# Altium project AL115v20.PrjPcb
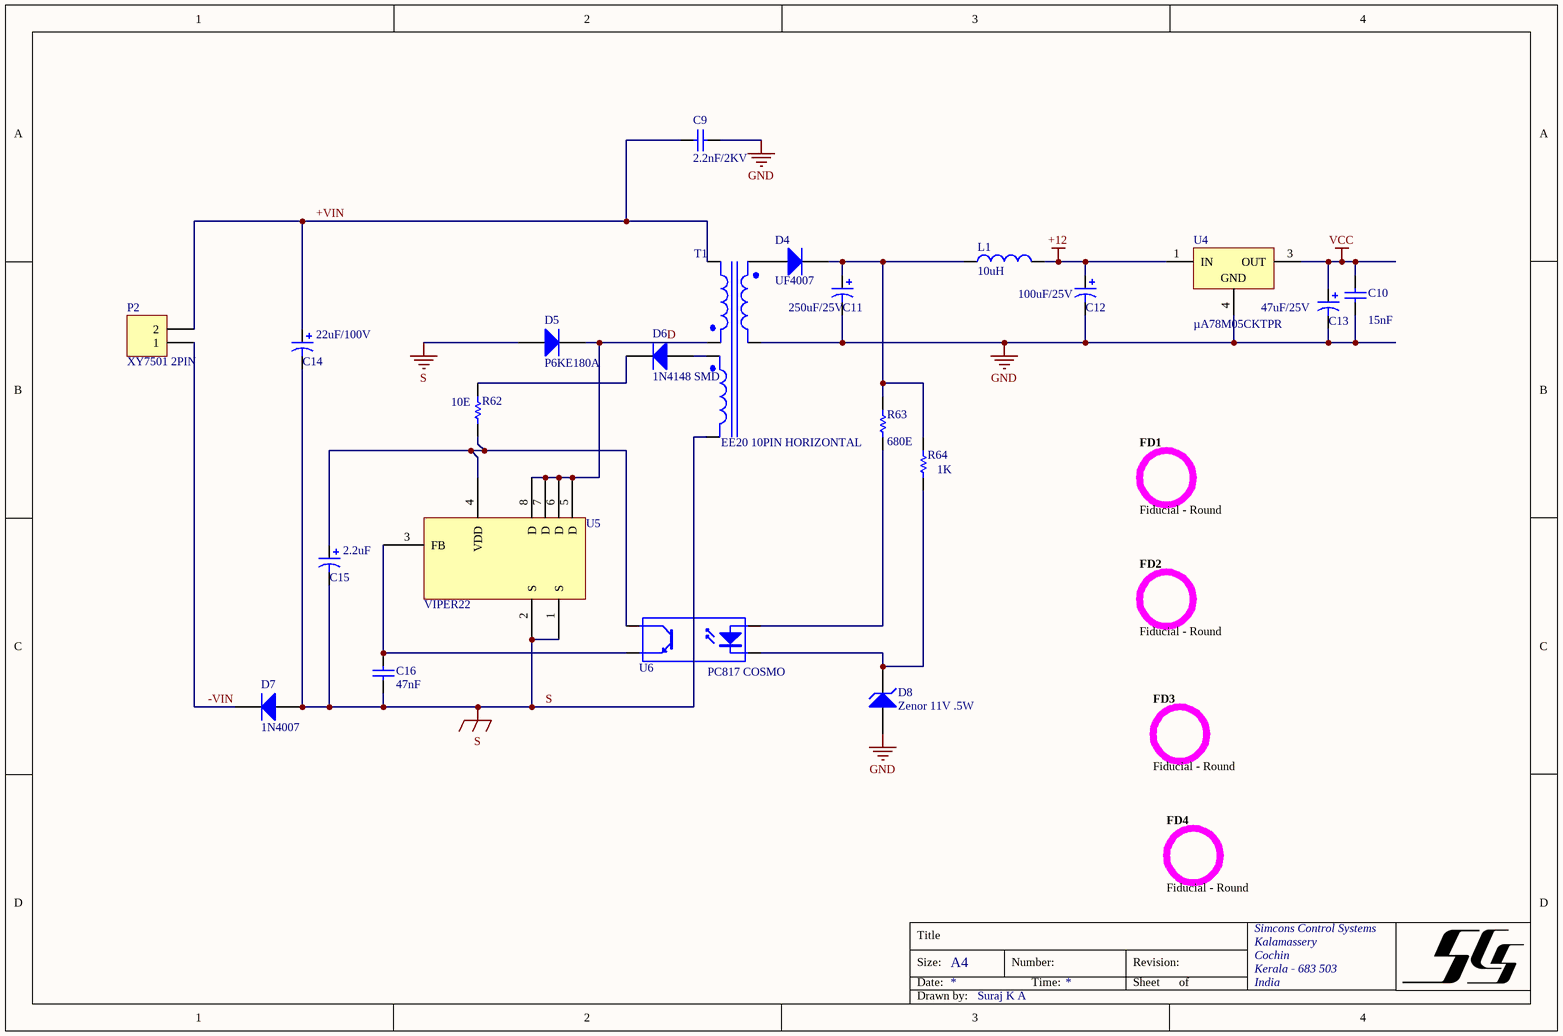
[diagram p0: al115v20_power.SchDoc]
4 sheets, 126 parts. Net scope: global (net labels, ports and power ports of the same name join across sheets).
Board file: AL115v20_pcb.PcbDoc
Sheets:
  al115v20_power.SchDoc
  al115v20_ac.SchDoc
  al115v20_mcu.SchDoc
  al115v20_relays.SchDoc

## Sheet al115v20_power.SchDoc
size A4; DrawnBy: Suraj K A; Engineer: Suraj K A; Organization: Simcons Control Systems; Address1: HMT Colony PO; Address2: Kalamassery; Address3: Cochin; Address4: India

### Parts
C9  2.2nF/2kV  [CAP DISC .2]
C10  value 15nF  [C1206]  (hidden comment: .1uF 1206)
C11  value 250uF/25V  [Cap_.2]  (hidden comment: 470uF/25V)
C12  100uF/25V  [Cap_.6.3x11x2.5]
C13  value 47uF/25V  [Cap_.6.3x11x2.5]  (hidden comment: 100uF/25V)
C14  22uF/100V  [Cap_.2]
C15  value 2.2uF  [Cap_.1]  (hidden comment: 10uF/63V)
C16  value 47nF  [C1206]  (hidden comment: 47nF 1206)
D4  UF4007  [DIODE1A]
D5  P6KE180A  [DIODE1A]
D6  1N4148 SMD  [4148SMDW]
D7  1N4007  [DIODE1A]
D8  Zenor 11V .5W  [DZENOR .25W - duplicate]
FD1  Fiducial - Round  [FIDUCIAL 2mm]
FD2  Fiducial - Round  [FIDUCIAL 2mm]
FD3  Fiducial - Round  [FIDUCIAL 2MM]
FD4  Fiducial - Round  [FIDUCIAL 2MM]
L1  value 10uH  [INDUCTOR 5x8]  (hidden comment: Inductor 10uH Drum Core)
P2  XY7501 2PIN  [XY7501_7.62_2PIN]
R62  value 10E  [R1206]  (hidden comment: 10E 1206)
R63  value 680E  [R1206]  (hidden comment: 100E 1206)
R64  value 1K  [R1206]  (hidden comment: 1K 1206)
T1  EE20 10PIN HORIZONTAL  [EE20_HOR_10PIN]
U4  µA78M05CKTPR  [TO252AA]
U5  VIPER22  [DIP-8_S]
U6  PC817 COSMO  [DIP-4_S]

### Nets
+12: C12.1 L1.2 U4.1(IN)
GND: C9.1 C10.1 C11.2 C12.2 C13.2 D8.1(A) T1.7(Sec1-) U4.4(GND)
S: C14.2 C15.2 C16.2 D5.1(A) D7.1(A) T1.5(Sec2+) U5.1(S) U5.2(S)
VCC: C10.2 C13.1 U4.3(OUT)
+VIN: C9.2 C14.1 P2.2 T1.1(Pri+)
-VIN: D7.2(K) P2.1
D: D5.2(K) T1.2(Pri-) U5.5(D) U5.6(D) U5.7(D) U5.8(D)
NetC11_1: C11.1 D4.2(K) L1.1 R63.2 R64.2
NetC15_1: C15.1 R62.1 U5.4(VDD) U6.4(C)
NetC16_1: C16.1 U5.3(FB) U6.3(E)
NetD4_1: D4.1(A) T1.9(Sec1+)
NetD6_1: D6.1(A) T1.4(Sec2-)
NetD6_2: D6.2(K) R62.2
NetD8_2: D8.2(K) R64.1 U6.2(K)
NetR63_1: R63.1 U6.1(A)

### Notes on the sheet
- Title
- Size:
- Date:
- A4
- Number:
- Time:
- Revision:
- Sheet
- of
- Simcons Control Systems
- Kalamassery
- Cochin
- Kerala - 683 503
- India
- Drawn by:

### Library data of the parts
C9 C10 C16 = Cap: Capacitor; Published: 8-Jun-2000; LatestRevisionDate: 17-Jul-2002; LatestRevisionNote: Re-released for DXP Platform.; PackageReference: RAD-0.3; Publisher: Altium Limited; PackageDescription: Radial Cap, Thru-Hole; 2 Leads; 0.3 in Pin Spacing
  C9: Value: 2.2nF/2KV
C11-C15 = Cap Pol1: Polarized Capacitor (Radial); Published: 8-Jun-2000; LatestRevisionDate: 17-Jul-2002; LatestRevisionNote: Re-released for DXP Platform.; PackageReference: RB7.6-15; Publisher: Altium Limited; PackageDescription: Polarized Capacitor (Radial); 2 Leads
  C12: Value: 100uF/25V
  C14: Value: 22uF/100V
D4-D7 = Diode: Default Diode; Published: 8-Jun-2000; LatestRevisionDate: 17-Jul-2002; LatestRevisionNote: Re-released for DXP Platform.; PackageVersion: Sep-1996; PackageReference: SMC; Publisher: Altium Limited; PackageDescription: DO-214-AB/SMC; 2 C-Bend Leads; Body 7.9 x 5.9 mm, inc. leads (LxW); Code_JEDEC: DO-214-AB
D8 = D Zener: Zener Diode; Published: 8-Jun-2000; LatestRevisionDate: 17-Jul-2002; LatestRevisionNote: Re-released for DXP Platform.; PackageReference: DIODE-0.7; Publisher: Altium Limited; PackageDescription: Diode, Thru-Hole; 2 Leads; 0.7 in Pin Spacing
FD1-FD4 = FIDUCIAL ROUND: Fiducial - Round 1.5mm Top-Bottom; Status: Unreleased; Category: Graphic-PCB
L1 = Inductor: Code_IEC: 1005; Published: 8-Jun-2000; LatestRevisionDate: 29-May-2009; LatestRevisionNote: IPC-7351 Footprint Added.; PackageReference: 0402-A; Publisher: Altium Limited; PackageDescription: Chip Inductor; Code_JEITA: 0402
P2 = Header 2: Header, 2-Pin; LatestRevisionDate: 17-Jul-2002; LatestRevisionNote: Re-released for DXP Platform.; Publisher: Altium Limited
R62 = Res Semi: Semiconductor Resistor; Published: 8-Jun-2000; LatestRevisionDate: 17-Jul-2002; LatestRevisionNote: Re-released for DXP Platform.; PackageReference: AXIAL-0.5; Publisher: Altium Limited; PackageDescription: Axial Device, Thru-Hole; 2 Leads; 0.5 in Pin Spacing
R63 R64 = Res1: Resistor; Published: 8-Jun-2000; LatestRevisionDate: 17-Jul-2002; LatestRevisionNote: Re-released for DXP Platform.; PackageReference: AXIAL-0.3; Publisher: Altium Limited; PackageDescription: Axial Device, Thru-Hole; 2 Leads; 0.3 in Pin Spacing
T1 = TransSwitching: Three-winding Transformer (Switching; Sim Note: Enter the turns ratios, Core loss resistance, Magnetising Reactance, Leakage Reactances and Resistances referred to the primary side into the parameter fields.; Published: 25-Jan-2001; LatestRevisionDate: 17-Jul-2002; LatestRevisionNote: Re-released for DXP Platform.; PackageReference: TRF_6; Publisher: Altium Limited; PackageDescription: Transformer; 6 Leads
U4 = µA78M05CKTPR: Positive-Voltage Regulator; Note: Pin 2 is electrically connected to pin4, and not drawn.; Published: 15-Apr-2002; DatasheetVersion: Jul-1999; PackageVersion: Jan-2001; PackageReference: KTP02; Publisher: Altium Limited; PackageDescription: PowerFLEX (D-PAK/TO-252-AA); 3 Leads (1 Cropped); Body 9.7 (inc. leads) x 6.2 mm (LxW max); Code_JEDEC: TO-252; ComponentLink1Description: Manufacturer Link; ComponentLink1URL: http://www.ti.com/; ComponentLink2Description: Datasheet; ComponentLink2URL: http://www-s.ti.com/sc/ds/ua78m05.pdf
U5 = VIPER22: Manufacturer: Power Integrations; PART NAME: Top Switch II Family
U6 = Optoisolator1: 4-Pin Phototransistor Optocoupler; Published: 24-Mar-1999; LatestRevisionDate: 04-Mar-2005; LatestRevisionNote: Sch pins 3 & 4 Swapped.; DatasheetVersion: Nov-2003; PackageReference: DIP-4; Publisher: Altium Limited

## Sheet al115v20_ac.SchDoc
size A4; DrawnBy: Suraj K A; Engineer: Suraj K A; Organization: Simcons Control Systems; Address1: HMT Colony PO; Address2: Kalamassery; Address3: Cochin; Address4: India
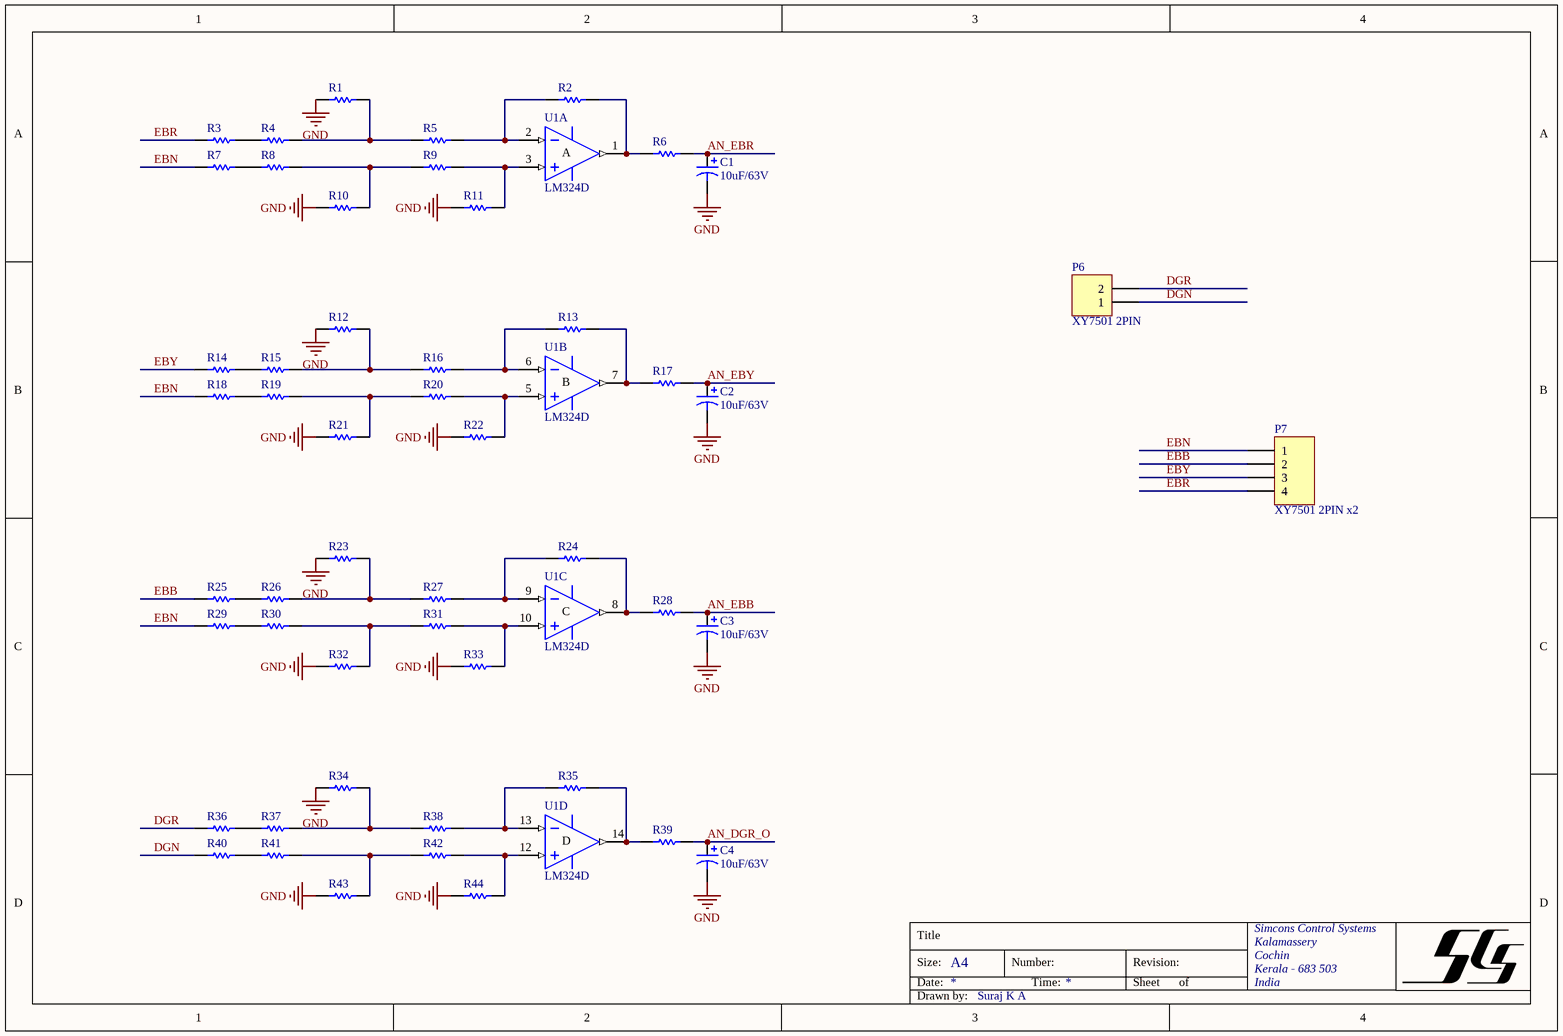
[diagram p1: al115v20_ac.SchDoc]

### Parts
C1  value 10uF/63V  [C1206]  (hidden comment: 1uF 1206)
C2  value 10uF/63V  [C1206]  (hidden comment: 1uF 1206)
C3  value 10uF/63V  [C1206]  (hidden comment: 1uF 1206)
C4  value 10uF/63V  [C1206]  (hidden comment: 1uF 1206)
P6  XY7501 2PIN  [XY7501_7.62_2PIN]
P7  XY7501 2PIN x2  [XY7501_7.62_4PIN]
R1  4.7K 1206  [R1206]  (value not drawn)
R2  1M 1206  [R1206]  (value not drawn)
R3  MFR 1M .5W  [AXIAL-0.5]  (value not drawn)
R4  MFR 1M .5W  [AXIAL-0.5]  (value not drawn)
R5  220K 1206  [R1206]  (value not drawn)
R6  470K 1206  [R1206]  (value not drawn)
R7  MFR 1M .5W  [AXIAL-0.5]  (value not drawn)
R8  MFR 1M .5W  [AXIAL-0.5]  (value not drawn)
R9  220K 1206  [R1206]  (value not drawn)
R10  4.7K 1206  [R1206]  (value not drawn)
R11  1M 1206  [R1206]  (value not drawn)
R12  4.7K 1206  [R1206]  (value not drawn)
R13  1M 1206  [R1206]  (value not drawn)
R14  MFR 1M .5W  [AXIAL-0.5]  (value not drawn)
R15  MFR 1M .5W  [AXIAL-0.5]  (value not drawn)
R16  220K 1206  [R1206]  (value not drawn)
R17  470K 1206  [R1206]  (value not drawn)
R18  MFR 1M .5W  [AXIAL-0.5]  (value not drawn)
R19  MFR 1M .5W  [AXIAL-0.5]  (value not drawn)
R20  220K 1206  [R1206]  (value not drawn)
R21  4.7K 1206  [R1206]  (value not drawn)
R22  1M 1206  [R1206]  (value not drawn)
R23  4.7K 1206  [R1206]  (value not drawn)
R24  1M 1206  [R1206]  (value not drawn)
R25  MFR 1M .5W  [AXIAL-0.5]  (value not drawn)
R26  MFR 1M .5W  [AXIAL-0.5]  (value not drawn)
R27  220K 1206  [R1206]  (value not drawn)
R28  470K 1206  [R1206]  (value not drawn)
R29  MFR 1M .5W  [AXIAL-0.5]  (value not drawn)
R30  MFR 1M .5W  [AXIAL-0.5]  (value not drawn)
R31  220K 1206  [R1206]  (value not drawn)
R32  4.7K 1206  [R1206]  (value not drawn)
R33  1M 1206  [R1206]  (value not drawn)
R34  4.7K 1206  [R1206]  (value not drawn)
R35  1M 1206  [R1206]  (value not drawn)
R36  MFR 1M .5W  [AXIAL-0.5]  (value not drawn)
R37  MFR 1M .5W  [AXIAL-0.5]  (value not drawn)
R38  220K 1206  [R1206]  (value not drawn)
R39  470K 1206  [R1206]  (value not drawn)
R40  MFR 1M .5W  [AXIAL-0.5]  (value not drawn)
R41  MFR 1M .5W  [AXIAL-0.5]  (value not drawn)
R42  220K 1206  [R1206]  (value not drawn)
R43  4.7K 1206  [R1206]  (value not drawn)
R44  1M 1206  [R1206]  (value not drawn)
U1  LM324D  [SOIC14_M]  (parts A,B,C,D of 4)

### Nets
GND: C1.2 C2.2 C3.2 C4.2 R1.2 R10.2 R11.2 R12.2 R21.2 R22.2 R23.2 R32.2 R33.2 R34.2 R43.2 R44.2 U1.11(V-)
VCC: U1.4(V+)
AN_DGR_O: C4.1 R39.1
AN_EBB: C3.1 R28.1
AN_EBR: C1.1 R6.1
AN_EBY: C2.1 R17.1
DGN: P6.1 R40.1
DGR: P6.2 R36.1
EBB: P7.2 R25.1
EBN: P7.1 R7.1 R18.1 R29.1
EBR: P7.4 R3.1
EBY: P7.3 R14.1
NetR1_1: R1.1 R4.2 R5.2
NetR2_1: R2.1 R6.2 U1.1(OUT)
NetR2_2: R2.2 R5.1 U1.2(IN-)
NetR3_2: R3.2 R4.1
NetR7_2: R7.2 R8.1
NetR8_2: R8.2 R9.2 R10.1
NetR9_1: R9.1 R11.1 U1.3(IN+)
NetR12_1: R12.1 R15.2 R16.2
NetR13_1: R13.1 R17.2 U1.7(OUT)
NetR13_2: R13.2 R16.1 U1.6(IN-)
NetR14_2: R14.2 R15.1
NetR18_2: R18.2 R19.1
NetR19_2: R19.2 R20.2 R21.1
NetR20_1: R20.1 R22.1 U1.5(IN+)
NetR23_1: R23.1 R26.2 R27.2
NetR24_1: R24.1 R28.2 U1.8(OUT)
NetR24_2: R24.2 R27.1 U1.9(IN-)
NetR25_2: R25.2 R26.1
NetR29_2: R29.2 R30.1
NetR30_2: R30.2 R31.2 R32.1
NetR31_1: R31.1 R33.1 U1.10(IN+)
NetR34_1: R34.1 R37.2 R38.2
NetR35_1: R35.1 R39.2 U1.14(OUT)
NetR35_2: R35.2 R38.1 U1.13(IN-)
NetR36_2: R36.2 R37.1
NetR40_2: R40.2 R41.1
NetR41_2: R41.2 R42.2 R43.1
NetR42_1: R42.1 R44.1 U1.12(IN+)

### Notes on the sheet
- Title
- Size:
- Date:
- A4
- Number:
- Time:
- Revision:
- Sheet
- of
- Simcons Control Systems
- Kalamassery
- Cochin
- Kerala - 683 503
- India
- Drawn by:
- (in symbol LM324D, part A) A
- (in symbol LM324D, part B) B
- (in symbol LM324D, part C) C
- (in symbol LM324D, part D) D

### Library data of the parts
C1-C4 = Cap Pol1: Polarized Capacitor (Radial); Published: 8-Jun-2000; LatestRevisionDate: 17-Jul-2002; LatestRevisionNote: Re-released for DXP Platform.; PackageReference: RB7.6-15; Publisher: Altium Limited; PackageDescription: Polarized Capacitor (Radial); 2 Leads
P6 = Header 2: Header, 2-Pin; LatestRevisionDate: 17-Jul-2002; LatestRevisionNote: Re-released for DXP Platform.; Publisher: Altium Limited
P7 = Header 4: Header, 4-Pin; LatestRevisionDate: 17-Jul-2002; LatestRevisionNote: Re-released for DXP Platform.; Publisher: Altium Limited
R1-R5 R7-R16 R18-R27 R29-R38 R40-R44 = Res Semi: Semiconductor Resistor; Published: 8-Jun-2000; LatestRevisionDate: 17-Jul-2002; LatestRevisionNote: Re-released for DXP Platform.; PackageReference: AXIAL-0.5; Publisher: Altium Limited; PackageDescription: Axial Device, Thru-Hole; 2 Leads; 0.5 in Pin Spacing
  R1 R10 R12 R21 R23 R32 R34 R43: Value: 4.7K
  R2-R4 R7 R8 R11 R13-R15 R18 R19 R22 R24-R26 R29 R30 R33 R35-R37 R40 R41 R44: Value: 1M
  R5 R9 R16 R20 R27 R31 R38 R42: Value: 220K
R6 R17 R28 R39 = Res Semi: Semiconductor Resistor; Value: 33K; Published: 8-Jun-2000; LatestRevisionDate: 17-Jul-2002; LatestRevisionNote: Re-released for DXP Platform.; PackageReference: AXIAL-0.5; Publisher: Altium Limited; PackageDescription: Axial Device, Thru-Hole; 2 Leads; 0.5 in Pin Spacing
U1 = LM324D: Quadruple Operational Amplifier; Published: 16-Jan-2001; LatestRevisionDate: 13-Apr-2006; LatestRevisionNote: IPC-7351 Footprint Added.; DatasheetVersion: Feb-1997; PackageVersion: Jan-1998; PackageReference: D014; Publisher: Altium Limited; PackageDescription: 14-Pin Small Outline Integrated Circuit 1.27 mm Pitch; Code_IPC: SOIC127P600-14; ComponentLink1Description: Manufacturer Link; ComponentLink1URL: http://www.ti.com/; ComponentLink2Description: Datasheet; ComponentLink2URL: http://www-s.ti.com/sc/ds/lm324.pdf

## Sheet al115v20_mcu.SchDoc
size A4; DrawnBy: Suraj K A; Engineer: Suraj K A; Organization: Simcons Control Systems; Address1: HMT Colony PO; Address2: Kalamassery; Address3: Cochin; Address4: India
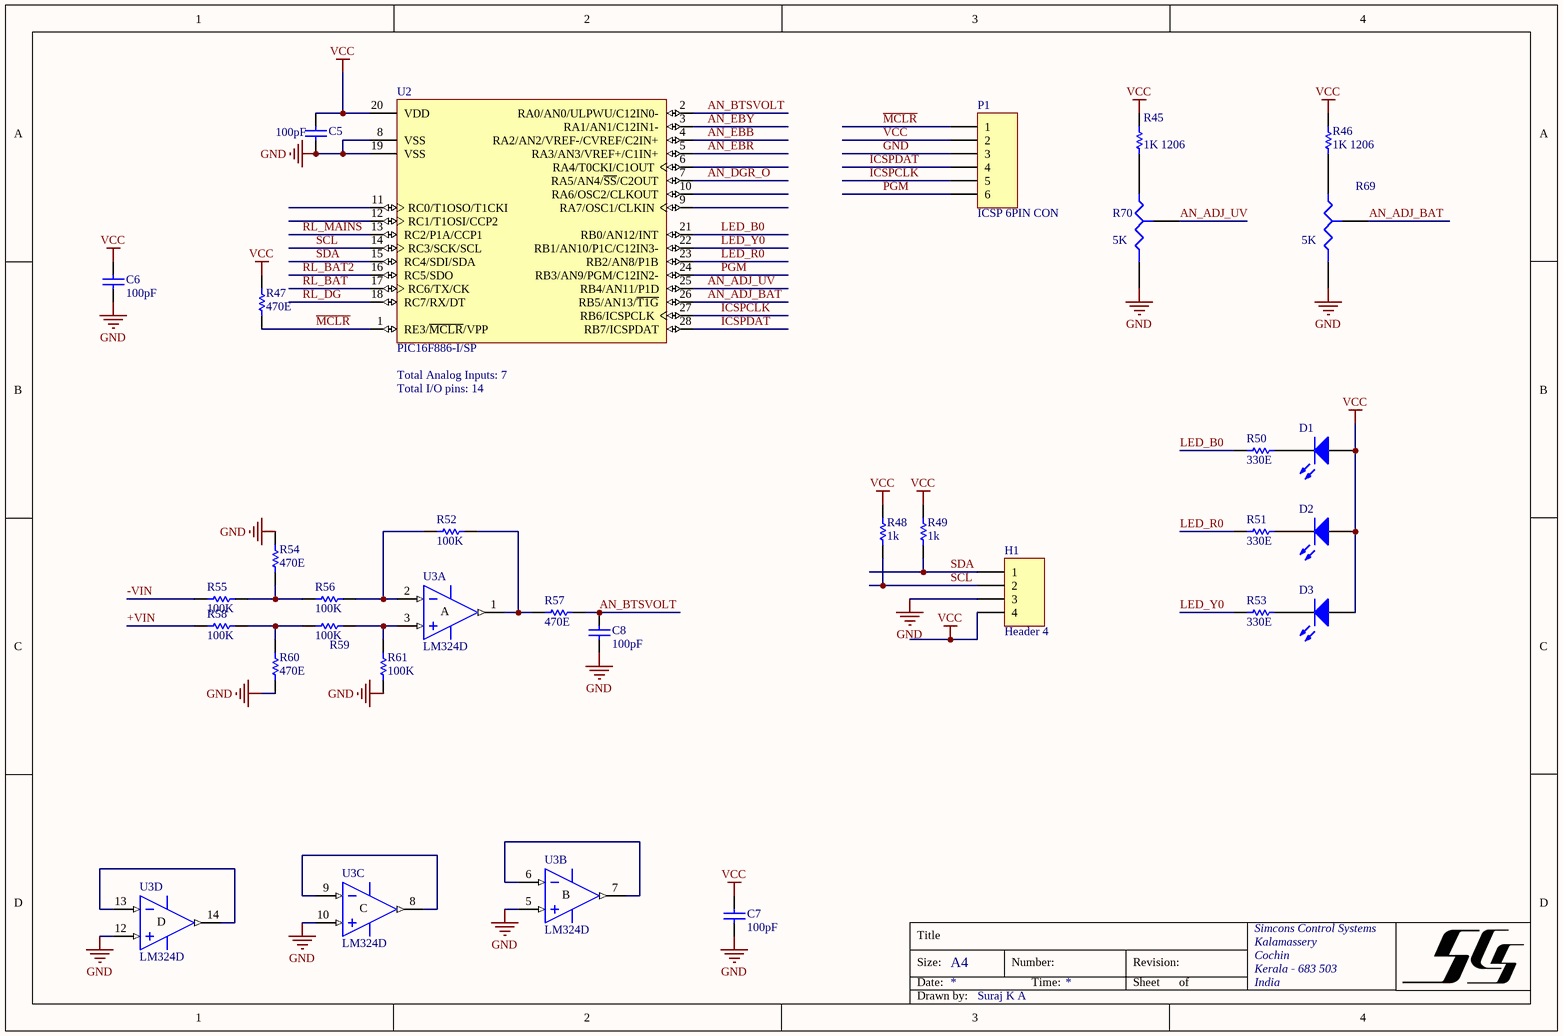
[diagram p2: al115v20_mcu.SchDoc]

### Parts
C5  value 100pF  [C1206]  (hidden comment: .1uF 1206)
C6  value 100pF  [C1206]  (hidden comment: .1uF 1206)
C7  value 100pF  [C1206]  (hidden comment: .1uF 1206)
C8  value 100pF  [C1206]  (hidden comment: 1uF 1206)
D1  LED W/B 5MM  [LED5mmBLUE]  (value not drawn)
D2  LED W/R 5MM  [LED5mmRED]  (value not drawn)
D3  LED W/Y 5MM  [LED5mmYELLOW]  (value not drawn)
H1  Header 4  [CONNDEBUG]
P1  ICSP 6PIN CON  [CON_ICSP]
R45  1K 1206  [R1206]
R46  1K 1206  [R1206]
R47  value 470E  [R1206]  (hidden comment: 4.7K 1206)
R48  value 1k  [R1206]  (hidden comment: 4.7K 1206)
R49  value 1k  [R1206]  (hidden comment: 4.7K 1206)
R50  value 330E  [R1206]  (hidden comment: 1K 1206)
R51  value 330E  [R1206]  (hidden comment: 1K 1206)
R52  value 100K  [R1206]  (hidden comment: 1M 1206)
R53  value 330E  [R1206]  (hidden comment: 1K 1206)
R54  value 470E  [R1206]  (hidden comment: 47K 1206)
R55  value 100K  [AXIAL-0.5]  (hidden comment: MFR 1M .5W)
R56  value 100K  [R1206]  (hidden comment: 1M 1206)
R57  value 470E  [R1206]  (hidden comment: 470K 1206)
R58  value 100K  [AXIAL-0.5]  (hidden comment: MFR 1M .5W)
R59  value 100K  [R1206]  (hidden comment: 1M 1206)
R60  value 470E  [R1206]  (hidden comment: 47K 1206)
R61  value 100K  [R1206]  (hidden comment: 1M 1206)
R69  value 5K  [Bourns_3306F]  (hidden comment: PRESET 5K)
R70  value 5K  [Bourns_3306F]  (hidden comment: PRESET 5K)
U2  PIC16F886-I/SP  [SOIC-SO28_M]
U3  LM324D  [SOIC14_M]  (parts A,B,C,D of 4)

### Nets
GND: C5.1 C6.1 C7.1 C8.1 H1.3 P1.3 R54.1 R60.2 R61.2 R69.3(B) R70.3(B) U2.8(VSS) U2.19(VSS) U3.5(IN+) U3.10(IN+) U3.11(V-) U3.12(IN+)
VCC: C5.2 C6.2 C7.2 D1.1(A) D2.1(A) D3.1(A) H1.4 P1.2 R45.2 R46.2 R47.1 R48.1 R49.1 U2.20(VDD) U3.4(V+)
+VIN: R58.2
-VIN: R55.2
AN_ADJ_BAT: R69.2(TAP) U2.26(RB5/AN13/~{T1G})
AN_ADJ_UV: R70.2(TAP) U2.25(RB4/AN11/P1D)
AN_BTSVOLT: C8.2 R57.2 U2.2(RA0/AN0/ULPWU/C12IN0-)
AN_DGR_O: U2.7(RA5/AN4/~{SS}/C2OUT)
AN_EBB: U2.4(RA2/AN2/VREF-/CVREF/C2IN+)
AN_EBR: U2.5(RA3/AN3/VREF+/C1IN+)
AN_EBY: U2.3(RA1/AN1/C12IN1-)
ICSPCLK: P1.5 U2.27(RB6/ICSPCLK)
ICSPDAT: P1.4 U2.28(RB7/ICSPDAT)
LED_B0: R50.1 U2.21(RB0/AN12/INT)
LED_R0: R51.1 U2.23(RB2/AN8/P1B)
LED_Y0: R53.1 U2.22(RB1/AN10/P1C/C12IN3-)
~{MCLR}: P1.1 R47.2 U2.1(RE3/~{MCLR}/VPP)
PGM: P1.6 U2.24(RB3/AN9/PGM/C12IN2-)
RL_BAT: U2.17(RC6/TX/CK)
RL_BAT2: U2.16(RC5/SDO)
RL_DG: U2.18(RC7/RX/DT)
RL_MAINS: U2.13(RC2/P1A/CCP1)
SCL: H1.2 R48.2 U2.14(RC3/SCK/SCL)
SDA: H1.1 R49.2 U2.15(RC4/SDI/SDA)
NetD1_2: D1.2(K) R50.2
NetD2_2: D2.2(K) R51.2
NetD3_2: D3.2(K) R53.2
NetR45_1: R45.1 R70.1(A)
NetR46_1: R46.1 R69.1(A)
NetR52_1: R52.1 R57.1 U3.1(OUT)
NetR52_2: R52.2 R56.1 U3.2(IN-)
NetR54_2: R54.2 R55.1 R56.2
NetR58_1: R58.1 R59.2 R60.1
NetR59_1: R59.1 R61.1 U3.3(IN+)
NetU3_6: U3.6(IN-) U3.7(OUT)
NetU3_8: U3.8(OUT) U3.9(IN-)
NetU3_13: U3.13(IN-) U3.14(OUT)

Not connected (* = marked no-connect by the designer): U2 6(RA4/T0CKI/C1OUT) 9(RA7/OSC1/CLKIN) 10(RA6/OSC2/CLKOUT) 11(RC0/T1OSO/T1CKI) 12(RC1/T1OSI/CCP2)

### Notes on the sheet
- (near U2) Total Analog Inputs: 7
- Total I/O pins: 14
- Title
- Size:
- Date:
- A4
- Number:
- Time:
- Revision:
- Sheet
- of
- Simcons Control Systems
- Kalamassery
- Cochin
- Kerala - 683 503
- India
- Drawn by:
- (in symbol LM324D, part A) A
- (in symbol LM324D, part B) B
- (in symbol LM324D, part C) C
- (in symbol LM324D, part D) D

### Library data of the parts
C5-C8 = Cap: Capacitor; Published: 8-Jun-2000; LatestRevisionDate: 17-Jul-2002; LatestRevisionNote: Re-released for DXP Platform.; PackageReference: RAD-0.3; Publisher: Altium Limited; PackageDescription: Radial Cap, Thru-Hole; 2 Leads; 0.3 in Pin Spacing
D1-D3 = LED1: Typical RED GaAs LED; Published: 8-Jun-2000; LatestRevisionDate: 08-Jul-2005; LatestRevisionNote: Mech Layer 1 removed.; PackageReference: LED-1; Publisher: Altium Limited; PackageDescription: LED; 2 Leads
H1 = Header 4: Header, 4-Pin; LatestRevisionDate: 17-Jul-2002; LatestRevisionNote: Re-released for DXP Platform.; Publisher: Altium Limited
P1 = Header 6: Header, 6-Pin; LatestRevisionDate: 17-Jul-2002; LatestRevisionNote: Re-released for DXP Platform.; Publisher: Altium Limited
R45 R46 = Res SMT: Semiconductor Resistor; Value: 1.1K; Published: 8-Jun-2000; LatestRevisionDate: 17-Jul-2002; LatestRevisionNote: Re-released for DXP Platform.; PackageReference: AXIAL-0.5; Publisher: Altium Limited; PackageDescription: Axial Device, Thru-Hole; 2 Leads; 0.5 in Pin Spacing
R47-R49 R52 R54-R61 = Res Semi: Semiconductor Resistor; Published: 8-Jun-2000; LatestRevisionDate: 17-Jul-2002; LatestRevisionNote: Re-released for DXP Platform.; PackageReference: AXIAL-0.5; Publisher: Altium Limited; PackageDescription: Axial Device, Thru-Hole; 2 Leads; 0.5 in Pin Spacing
R50 R51 R53 = Res .4: Semiconductor Resistor; Published: 8-Jun-2000; LatestRevisionDate: 17-Jul-2002; LatestRevisionNote: Re-released for DXP Platform.; PackageReference: AXIAL-0.5; Publisher: Altium Limited; PackageDescription: Axial Device, Thru-Hole; 2 Leads; 0.5 in Pin Spacing
R69 R70 = Res Tap: Tapped Resistor; Sim Note: Enter the Resistance value and the set point into parameter fields.; Set Position: 0.5; Published: 24-Mar-1999; LatestRevisionDate: 17-Jul-2002; LatestRevisionNote: Re-released for DXP Platform.; PackageReference: VR3; Publisher: Altium Limited; PackageDescription: Variable Resistor, Thru-Hole; 3 Leads
U2 = PIC16F886-I/SP: Flash-Based, 8-Bit CMOS Microcontroller with nanoWatt Technology, 8K (x14-Bit words) Program Memory, 624 Bytes Data Memory, 24 I/O pins, 28-Pin SPDIP, Standard VDD Range, Industrial Temperature; Published: 29-Jan-2009; LatestRevisionDate: 02-Dec-2009; LatestRevisionNote: Updated datasheet to version revF, Apr-2009.; DatasheetVersion: revF, Apr-2009; PackageVersion: revBB, Aug-2009; PackageReference: SPDIP300-SP28; Publisher: Altium Limited; PackageDescription: 28-Lead Skinny Plastic Dual In-Line (SP) - 300 mil Body [SPDIP]; Supplier 1: Digi-Key; Supplier Part Number 1: PIC16F886-I/SP-ND; Supplier 2: Farnell; Supplier Part Number 2: 1439539; ComponentLink1Description: Datasheet; ComponentLink1URL: http://ww1.microchip.com/downloads/en/DeviceDoc/41291F.pdf; ComponentLink2Description: Packaging Specification; ComponentLink2URL: http://www.microchip.com/stellent/groups/techpub_sg/documents/packagingspec/en012702.pdf; ComponentLink3Description: Microchip.com Home; ComponentLink3URL: http://www.microchip.com/
U3 = LM324D: Quadruple Operational Amplifier; Published: 16-Jan-2001; LatestRevisionDate: 13-Apr-2006; LatestRevisionNote: IPC-7351 Footprint Added.; DatasheetVersion: Feb-1997; PackageVersion: Jan-1998; PackageReference: D014; Publisher: Altium Limited; PackageDescription: 14-Pin Small Outline Integrated Circuit 1.27 mm Pitch; Code_IPC: SOIC127P600-14; ComponentLink1Description: Manufacturer Link; ComponentLink1URL: http://www.ti.com/; ComponentLink2Description: Datasheet; ComponentLink2URL: http://www-s.ti.com/sc/ds/lm324.pdf

## Sheet al115v20_relays.SchDoc
size A4; DrawnBy: Suraj K A; Engineer: Suraj K A; Organization: Simcons Control Systems; Address1: HMT Colony PO; Address2: Kalamassery; Address3: Cochin; Address4: India
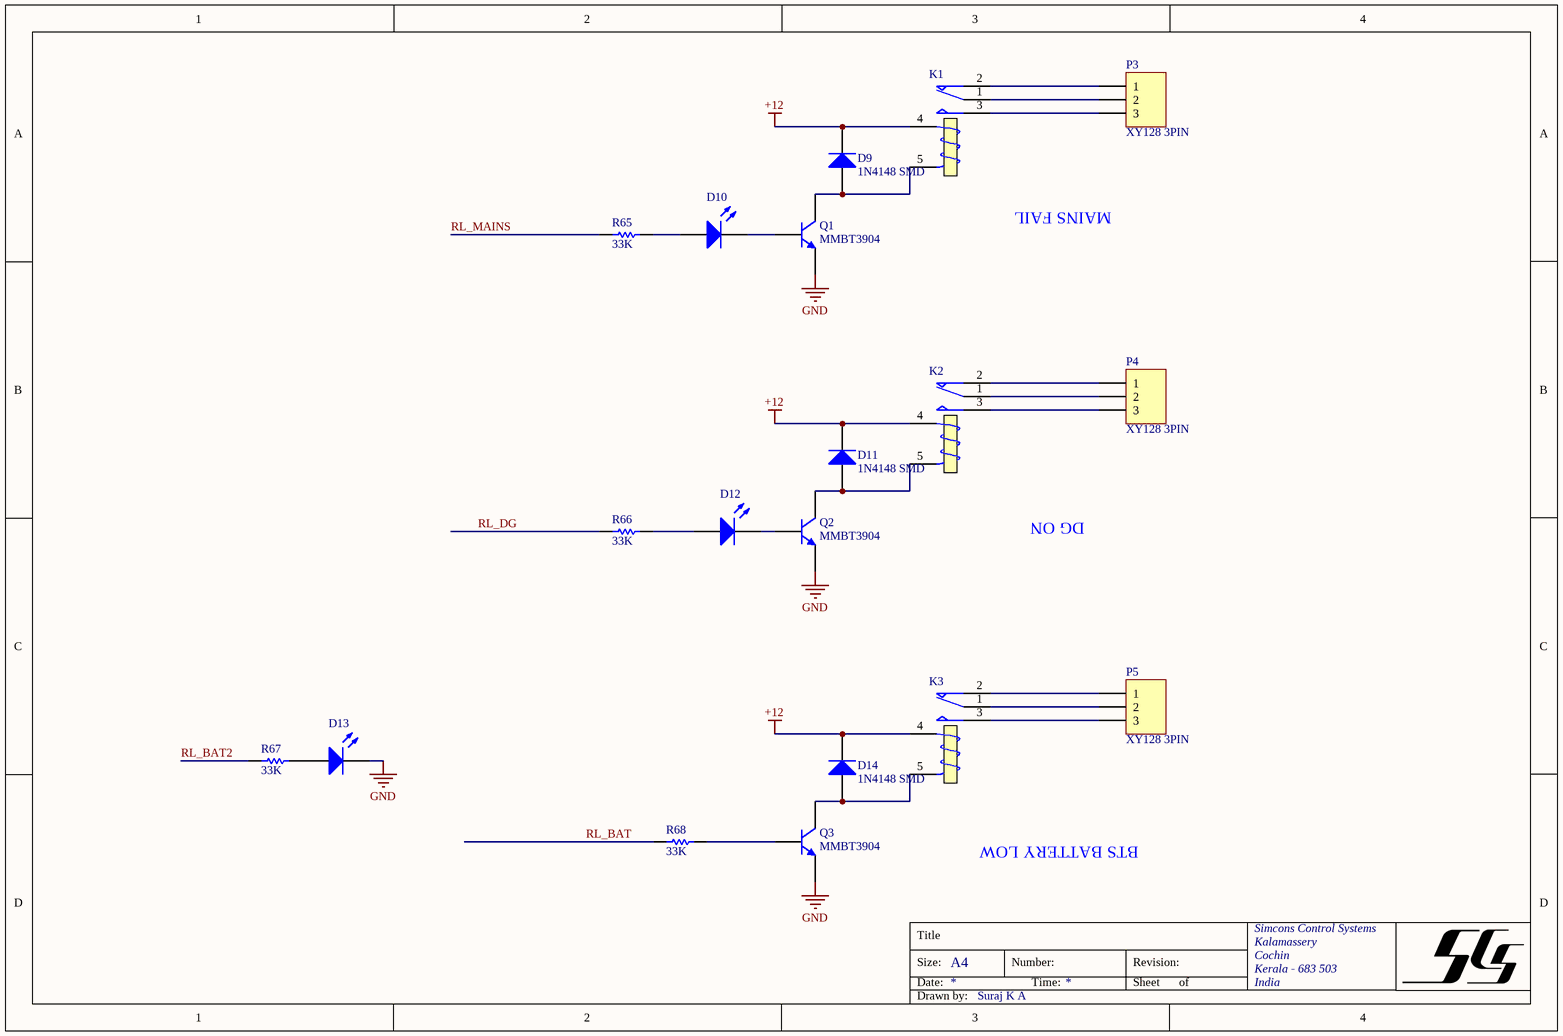
[diagram p3: al115v20_relays.SchDoc]

### Parts
D9  1N4148 SMD  [4148SMDW]
D10  LED R/R 5MM  [LEDSMALL]  (value not drawn)
D11  1N4148 SMD  [4148SMDW]
D12  LED R/R 5MM  [LEDSMALL]  (value not drawn)
D13  LED R/R 5MM  [LEDSMALL]  (value not drawn)
D14  1N4148 SMD  [4148SMDW]
K1  Relay  [RELAY]  (value not drawn)
K2  Relay  [RELAY]  (value not drawn)
K3  Relay  [RELAY]  (value not drawn)
P3  XY128 3PIN  [XY128_5.08_3PIN]
P4  XY128 3PIN  [XY128_5.08_3PIN]
P5  XY128 3PIN  [XY128_5.08_3PIN]
Q1  MMBT3904  [SOT23_M]
Q2  MMBT3904  [SOT23_M]
Q3  MMBT3904  [SOT23_M]
R65  value 33K  [R1206]  (hidden comment: 330E 1206)
R66  value 33K  [R1206]  (hidden comment: 330E 1206)
R67  value 33K  [R1206]  (hidden comment: 330E 1206)
R68  value 33K  [R1206]  (hidden comment: 4.7K 1206)

### Nets
+12: D9.2(K) D11.2(K) D14.2(K) K1.4(T1) K2.4(T1) K3.4(T1)
GND: D13.2(K) Q1.2(E) Q2.2(E) Q3.2(E)
RL_BAT: R68.2
RL_BAT2: R67.1
RL_DG: R66.2
RL_MAINS: R65.2
NetD9_1: D9.1(A) K1.5(T2) Q1.3(C)
NetD10_1: D10.1(A) R65.1
NetD10_2: D10.2(K) Q1.1(B)
NetD11_1: D11.1(A) K2.5(T2) Q2.3(C)
NetD12_1: D12.1(A) R66.1
NetD12_2: D12.2(K) Q2.1(B)
NetD13_1: D13.1(A) R67.2
NetD14_1: D14.1(A) K3.5(T2) Q3.3(C)
NetK1_1: K1.1(COM) P3.2
NetK1_2: K1.2(NC) P3.1
NetK1_3: K1.3(NO) P3.3
NetK2_1: K2.1(COM) P4.2
NetK2_2: K2.2(NC) P4.1
NetK2_3: K2.3(NO) P4.3
NetK3_1: K3.1(COM) P5.2
NetK3_2: K3.2(NC) P5.1
NetK3_3: K3.3(NO) P5.3
NetQ3_1: Q3.1(B) R68.1

### Notes on the sheet
- MAINS FAIL
- DG ON
- BTS BATTERY LOW
- Title
- Size:
- Date:
- A4
- Number:
- Time:
- Revision:
- Sheet
- of
- Simcons Control Systems
- Kalamassery
- Cochin
- Kerala - 683 503
- India
- Drawn by:

### Library data of the parts
D9 D11 D14 = Diode: Default Diode; Published: 8-Jun-2000; LatestRevisionDate: 17-Jul-2002; LatestRevisionNote: Re-released for DXP Platform.; PackageVersion: Sep-1996; PackageReference: SMC; Publisher: Altium Limited; PackageDescription: DO-214-AB/SMC; 2 C-Bend Leads; Body 7.9 x 5.9 mm, inc. leads (LxW); Code_JEDEC: DO-214-AB
D10 D12 D13 = LED1: Typical RED GaAs LED; Published: 8-Jun-2000; LatestRevisionDate: 08-Jul-2005; LatestRevisionNote: Mech Layer 1 removed.; PackageReference: LED-1; Publisher: Altium Limited; PackageDescription: LED; 2 Leads
K1-K3 = Relay: SPDT Relay; Published: 8-Jun-2000; LatestRevisionDate: 17-Jul-2002; LatestRevisionNote: Re-released for DXP Platform.; PackageReference: MODULE5B; Publisher: Altium Limited
P3-P5 = Header 3: Header, 3-Pin; LatestRevisionDate: 17-Jul-2002; LatestRevisionNote: Re-released for DXP Platform.; Publisher: Altium Limited
Q1-Q3 = BC847: NPN General-purpose Transistor; Published: 17-Sep-2003; LatestRevisionDate: 12-Dec-2006; LatestRevisionNote: IPC-7351 Footprint Added.; DatasheetVersion: 4-Feb-2002; PackageVersion: May-1999; PackageReference: SOT23; Publisher: Altium Limited; PackageDescription: 3-Pin SOT-23 Package 0.95 mm Pitch, 2.3 mm Lead Span; ComponentLink1Description: Manufacturer Link; ComponentLink1URL: http://www.semiconductors.philips.com/; ComponentLink2Description: Datasheet; ComponentLink2URL: http://www.semiconductors.philips.com/acrobat/datasheets/BC846_BC847_BC848_5.pdf
R65-R68 = Res Semi: Semiconductor Resistor; Published: 8-Jun-2000; LatestRevisionDate: 17-Jul-2002; LatestRevisionNote: Re-released for DXP Platform.; PackageReference: AXIAL-0.5; Publisher: Altium Limited; PackageDescription: Axial Device, Thru-Hole; 2 Leads; 0.5 in Pin Spacing

## Nets that join several sheets
+12: al115v20_power (C12.1 L1.2 U4.1), al115v20_relays (6 pins)
GND: al115v20_power (8 pins), al115v20_ac (17 pins), al115v20_mcu (17 pins), al115v20_relays (D13.2 Q1.2 Q2.2 Q3.2)
VCC: al115v20_power (C10.2 C13.1 U4.3), al115v20_ac (U1.4), al115v20_mcu (15 pins)
+VIN: al115v20_power (C9.2 C14.1 P2.2 T1.1), al115v20_mcu (R58.2)
-VIN: al115v20_power (D7.2 P2.1), al115v20_mcu (R55.2)
AN_DGR_O: al115v20_ac (C4.1 R39.1), al115v20_mcu (U2.7)
AN_EBB: al115v20_ac (C3.1 R28.1), al115v20_mcu (U2.4)
AN_EBR: al115v20_ac (C1.1 R6.1), al115v20_mcu (U2.5)
AN_EBY: al115v20_ac (C2.1 R17.1), al115v20_mcu (U2.3)
RL_BAT: al115v20_mcu (U2.17), al115v20_relays (R68.2)
RL_BAT2: al115v20_mcu (U2.16), al115v20_relays (R67.1)
RL_DG: al115v20_mcu (U2.18), al115v20_relays (R66.2)
RL_MAINS: al115v20_mcu (U2.13), al115v20_relays (R65.2)